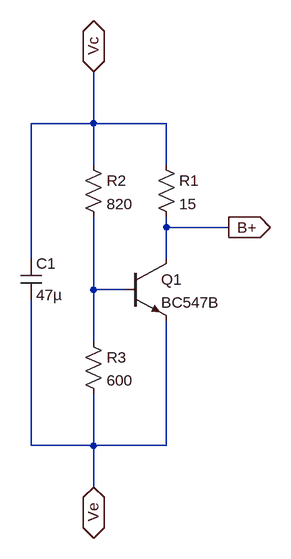
[diagram p0: schematic bias.asc]
bias.asc, the LTspice schematic file:
Version 4
SHEET 1 880 680
WIRE 112 -80 112 -160
WIRE 112 -80 16 -80
WIRE 224 -80 112 -80
WIRE 112 -16 112 -80
WIRE 224 -16 224 -80
WIRE 224 80 224 64
WIRE 320 80 224 80
WIRE 16 128 16 -80
WIRE 224 128 224 80
WIRE 112 176 112 64
WIRE 160 176 112 176
WIRE 112 256 112 176
WIRE 16 416 16 192
WIRE 112 416 112 336
WIRE 112 416 16 416
WIRE 224 416 224 224
WIRE 224 416 112 416
WIRE 112 480 112 416
FLAG 112 -160 Vc
IOPIN 112 -160 BiDir
FLAG 112 480 Ve
IOPIN 112 480 BiDir
FLAG 320 80 B+
IOPIN 320 80 Out
SYMBOL npn 160 128 R0
SYMATTR InstName Q1
SYMATTR Value BC547B
SYMBOL res 208 -32 R0
SYMATTR InstName R1
SYMATTR Value 15
SYMBOL res 96 -32 R0
SYMATTR InstName R2
SYMATTR Value 820
SYMBOL res 96 240 R0
SYMATTR InstName R3
SYMATTR Value 600
SYMBOL cap 0 128 R0
SYMATTR InstName C1
SYMATTR Value 47µ

The netlist it stands for:
* bias.asc
Q1 B+ N001 Ve 0 BC547B
R1 Vc B+ 15
R2 Vc N001 820
R3 N001 Ve 600
C1 Vc Ve 47µ
.model NPN NPN
.model PNP PNP
.lib standard.bjt
.backanno
.end